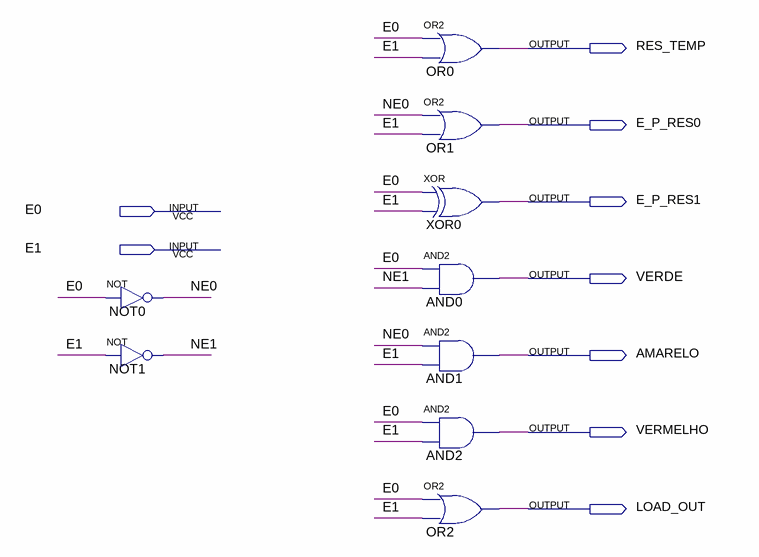
[diagram p0: schematic sheet]
// Quartus schematic LOG_SAIDA.bdf as structural Verilog: 9 symbols, 9 pins
module LOG_SAIDA (
  input  E0,
  input  E1,
  output RES_TEMP,
  output E_P_RES0,
  output E_P_RES1,
  output VERDE,
  output AMARELO,
  output VERMELHO,
  output LOAD_OUT
);

  wire NE0, NE1;

  not NOT0 (NE0, E0);
  not NOT1 (NE1, E1);
  or OR0 (RES_TEMP, E0, E1);
  or OR1 (E_P_RES0, NE0, E1);
  xor XOR0 (E_P_RES1, E0, E1);
  and AND0 (VERDE, E0, NE1);
  and AND1 (AMARELO, NE0, E1);
  and AND2 (VERMELHO, E0, E1);
  or OR2 (LOAD_OUT, E0, E1);
endmodule
